# Altium schematic sheet STM32-ROMI_Rev_A_5_Sensors.SchDoc
size A4; Organization: Altium Limited; Address1: L3, 12a Rodborough Rd; Address2: Frenchs Forest; Address3: NSW; Address4: Australia 2086
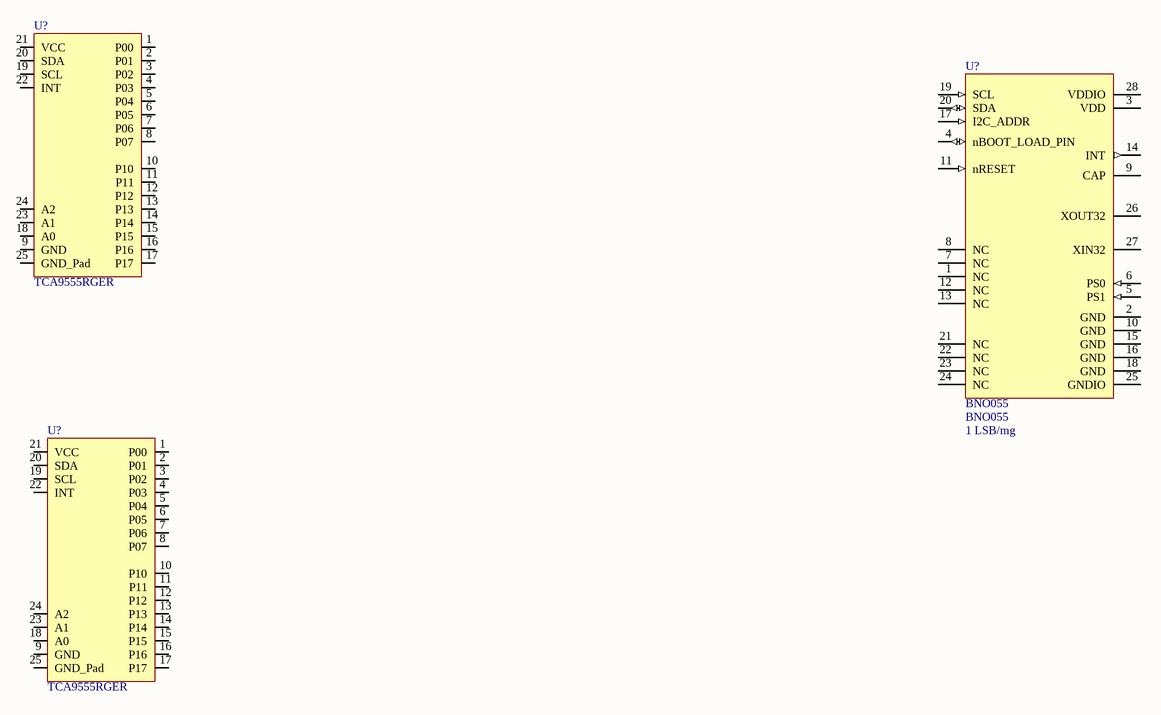
[diagram p0: STM32-ROMI_Rev_A_5_Sensors.SchDoc]

## Parts
(Parts that share a designator on the sheet are numbered #1, #2 ... from top to bottom, then left to right.)
U?#1  BNO055  Sensitivity: 1 LSB/mg  [LGA-28-3.8x5.2mm]
U?#2  TCA9555RGER  [QFN50P400X400X100_HS-25N]
U?#3  TCA9555RGER  [QFN50P400X400X100_HS-25N]

## Nets

Not connected (* = marked no-connect by the designer): U?#1 1(NC) 2(GND) 3(VDD) 4(nBOOT_LOAD_PIN) 5(PS1) 6(PS0) 7(NC) 8(NC) 9(CAP) 10(GND) 11(nRESET) 12(NC) 13(NC) 14(INT) 15(GND) 16(GND) 17(I2C_ADDR) 18(GND) 19(SCL) 20(SDA) 21(NC) 22(NC) 23(NC) 24(NC) 25(GNDIO) 26(XOUT32) 27(XIN32) 28(VDDIO); U?#2 1(P00) 2(P01) 3(P02) 4(P03) 5(P04) 6(P05) 7(P06) 8(P07) 9(GND) 10(P10) 11(P11) 12(P12) 13(P13) 14(P14) 15(P15) 16(P16) 17(P17) 18(A0) 19(SCL) 20(SDA) 21(VCC) 22(INT) 23(A1) 24(A2) 25(GND_Pad); U?#3 1(P00) 2(P01) 3(P02) 4(P03) 5(P04) 6(P05) 7(P06) 8(P07) 9(GND) 10(P10) 11(P11) 12(P12) 13(P13) 14(P14) 15(P15) 16(P16) 17(P17) 18(A0) 19(SCL) 20(SDA) 21(VCC) 22(INT) 23(A1) 24(A2) 25(GND_Pad)

## Notes on the sheet
- Title
- Size:
- Date:
- A4
- Number:
- Time:
- Revision:
- Sheet
- of
- File:

## Library data of the parts
U?#1 = CMP-010-0024-02: 9-Axis Intertial Sensor; Manufacturer: Bosch; Manufacturer: Bosch Tools; Bandwidth: 1000 Hz; Product Status: New at Mouser; Operating Supply Current: 13.7 mA; Interface: HID-I2C, I2C, UART; Supply Voltage - Max: 3.6 V; Brand: Bosch Sensortec; Acceleration: 2 g, 4 g, 8 g, 16 g; Supply Voltage - Min: 2.4 V; Resolution: 16 bit; RoHS - Mouser: Y; Sensing Axis: 9-axis; RoHS: RoHS Compliant; Pin Count: 28; ComponentLink1URL: http://www.mouser.com/ds/2/621/BST_BNO055_DS000_12~1-531239.pdf; Stock 1: 5828; Package / Case: LGA-28; Maximum Operating Temperature: + 85 C; Packaging: Bulk; Designator: BNO055; Component Name: BNO055; Minimum Order Quantity: 1; Minimum Operating Temperature: - 40 C; Reeling: False; ComponentLink1Description: http://www.mouser.com/ds/2/621/BST_BNO055_DS000_12~1-531239.pdf; Pricing 1: 1=17.58, 5=16.75, 10=16.43, 25=15.20, 50=15.01, 100=14.26, 250=13.30, 500=12.64, 1000=11.63 (AUD); Manufacturer: Bosch Sensortec; Manufacturer Part Number: BNO055
U?#2 U?#3 = CMP-001-0784-04: IC I/O EXPANDER I2C SMBUS 24VQFN; Manufacturer: Texas Instruments; Max Supply Voltage: 5.5V; Interface: I2C, SMBus; Number of I/Os: 16; Min Supply Voltage: 1.65V; Packaging: Cut Tape; Min Operating Temperature: -40°C; Case/Package: VQFN; REACH SVHC: No SVHC; Number of Pins: 24; Lead Free: Lead Free; Max Operating Temperature: 85°C; Manufacturer Part Number: TCA9555RGER